# Altium schematic sheet Cover Sheet.SchDoc
size B; Organization: Altium Limited; Address1: L3, 12a Rodborough Rd; Address2: Frenchs Forest; Address3: NSW; Address4: Australia 2086; SheetNumber: 1; SheetTotal: 1
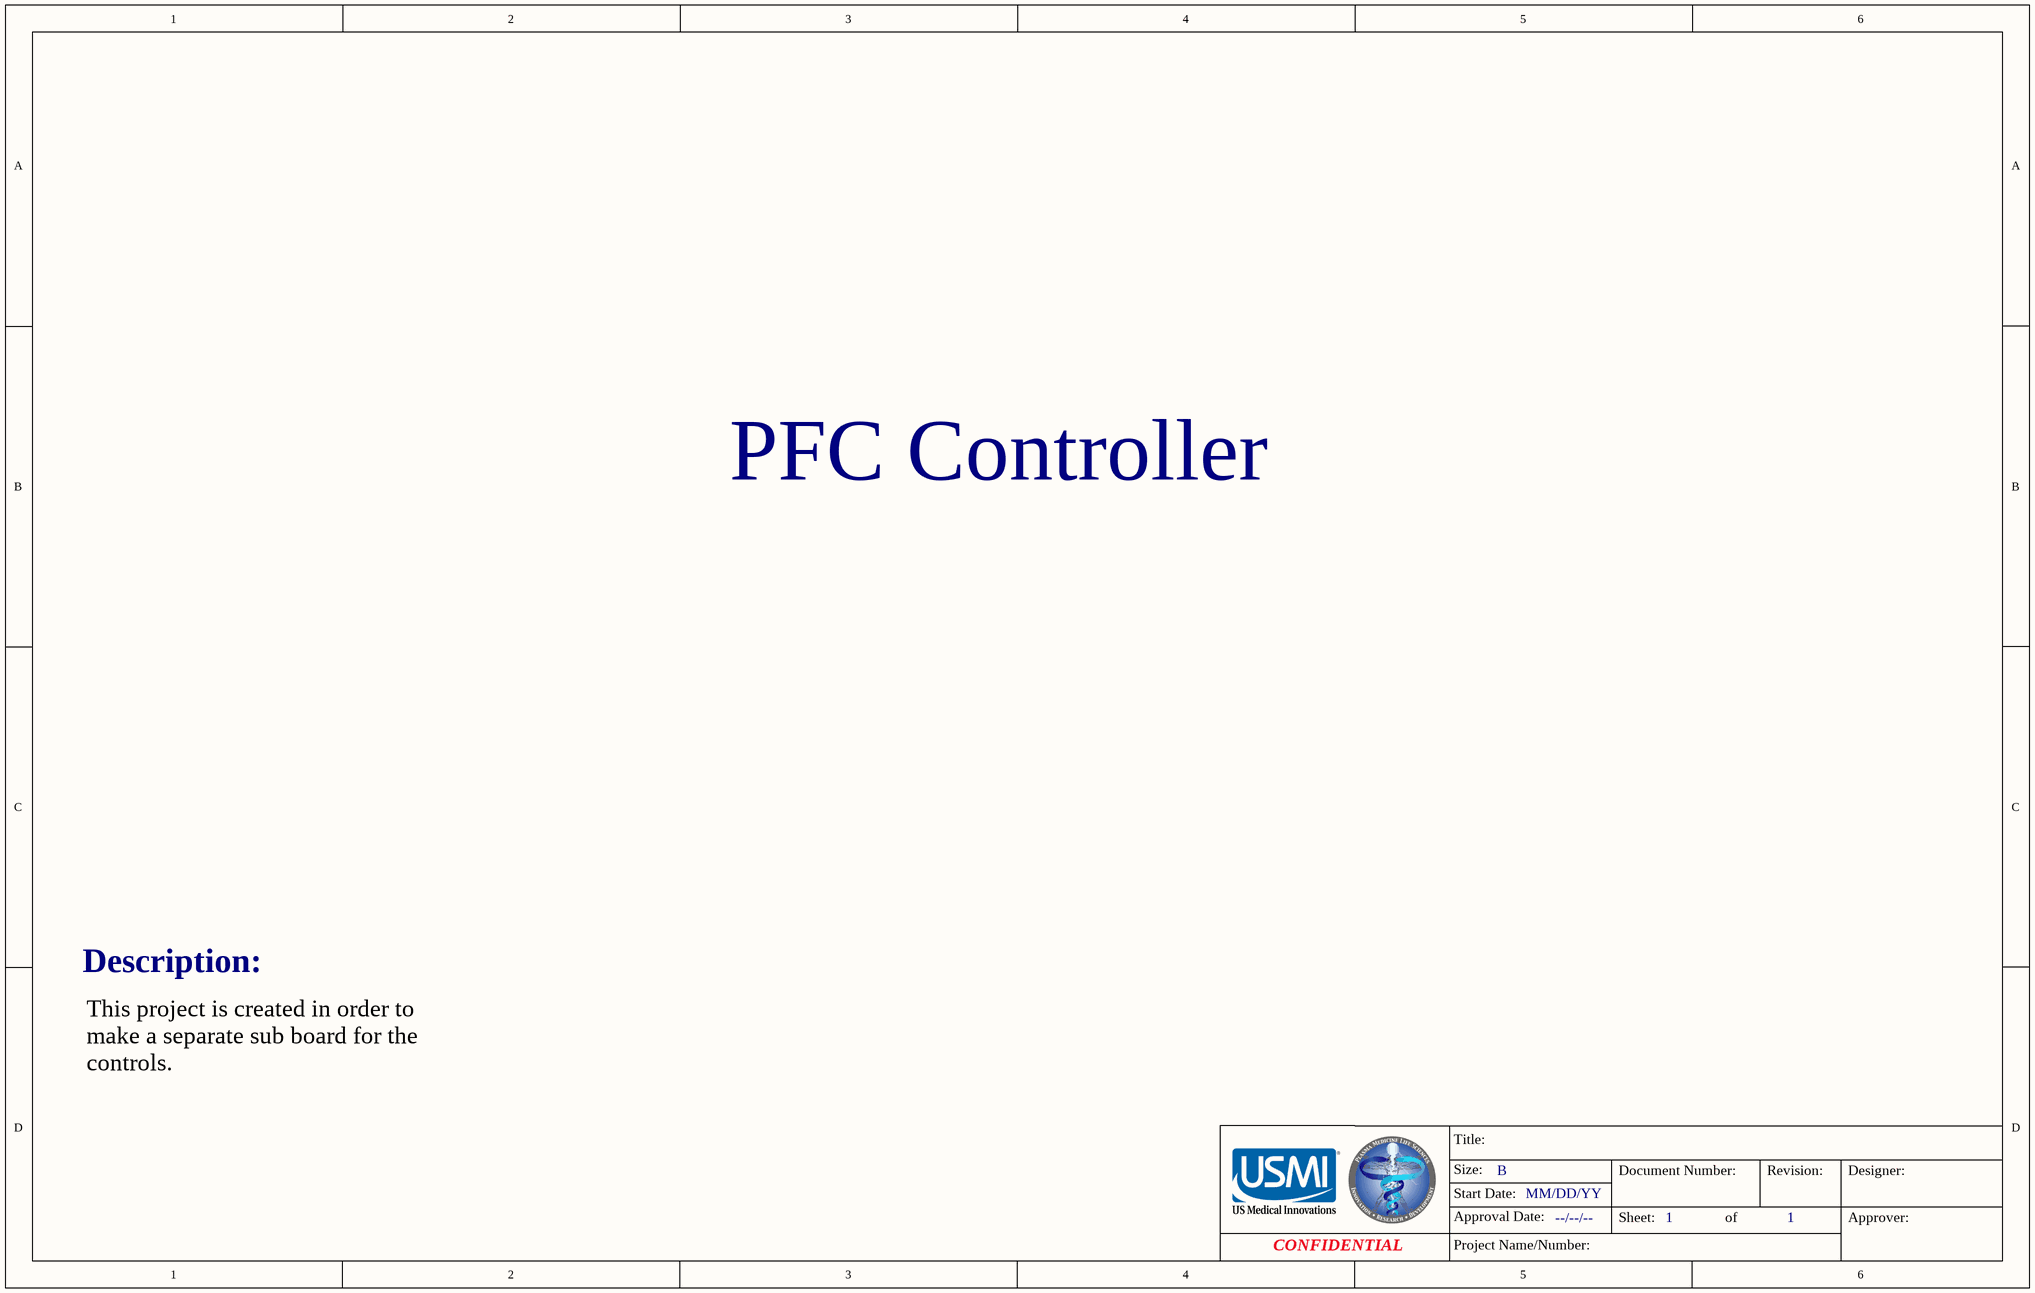
[diagram p0: Cover Sheet.SchDoc]

## Notes on the sheet
- PFC Controller
- Description:
- This project is created in order to make a separate sub board for the controls.
- Title:
- Size:
- B
- Document Number:
- Revision:
- Designer:
- Approval Date:
- Start Date:
- MM/DD/YY
- --/--/--
- Sheet:
- of
- Approver:
- CONFIDENTIAL
- Project Name/Number: